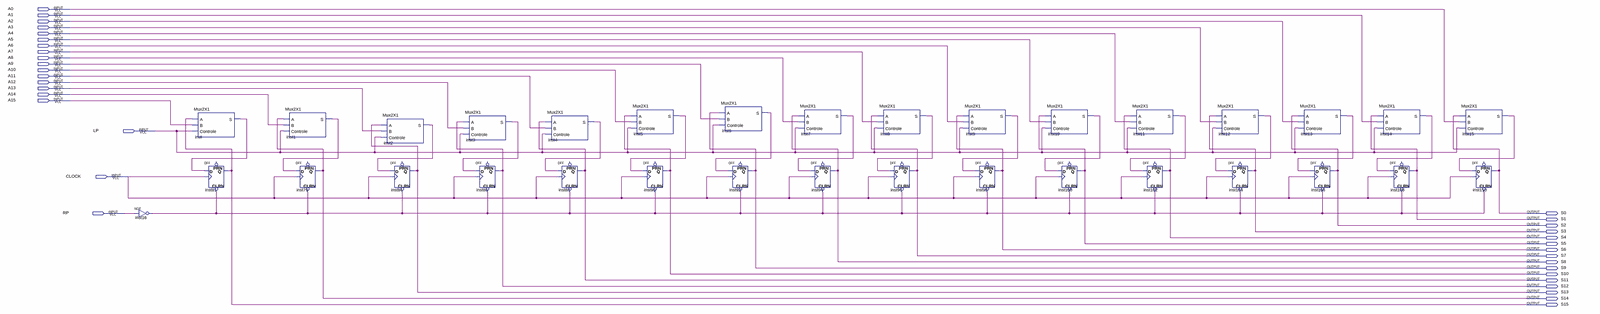
[diagram p0: schematic sheet, whole]
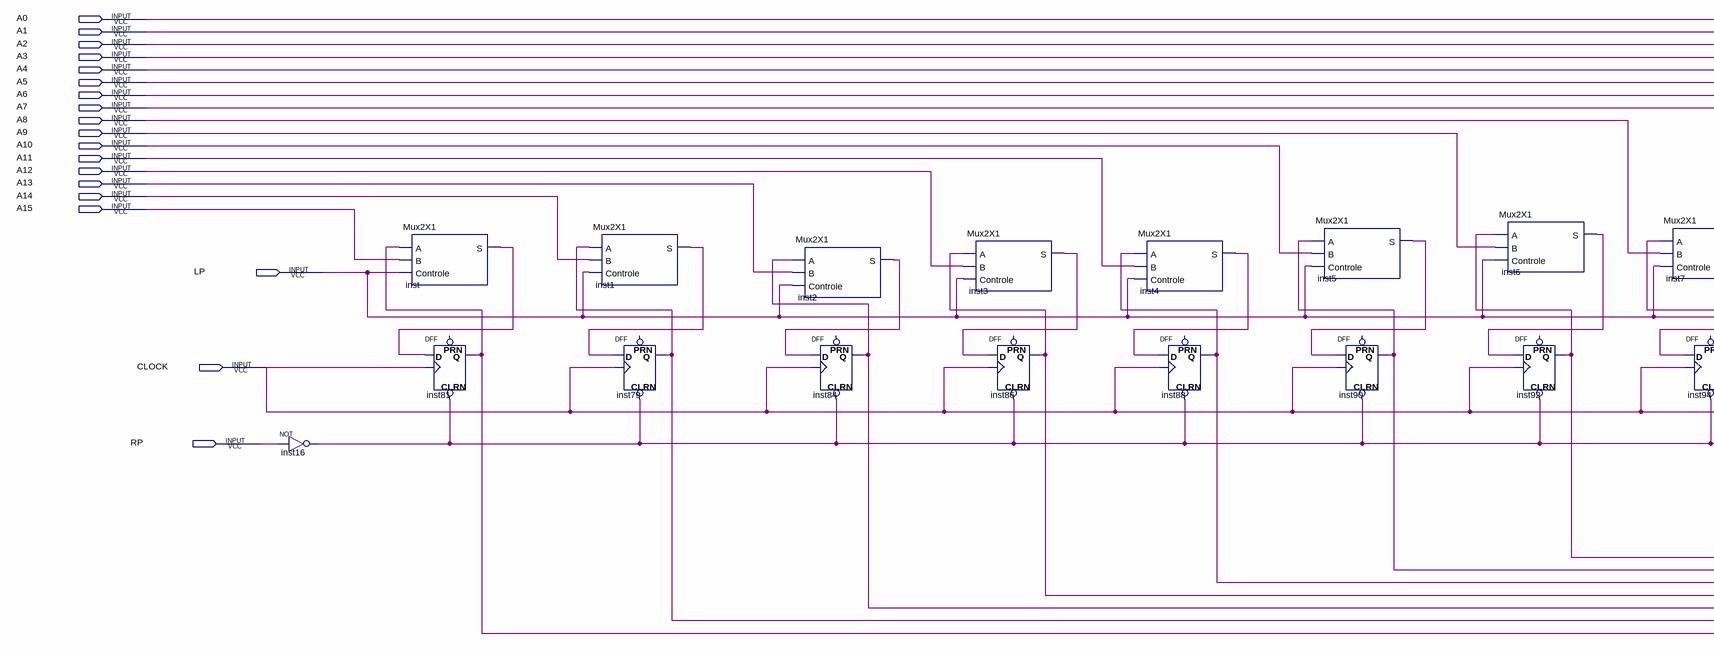
[diagram p1: schematic sheet, left part]
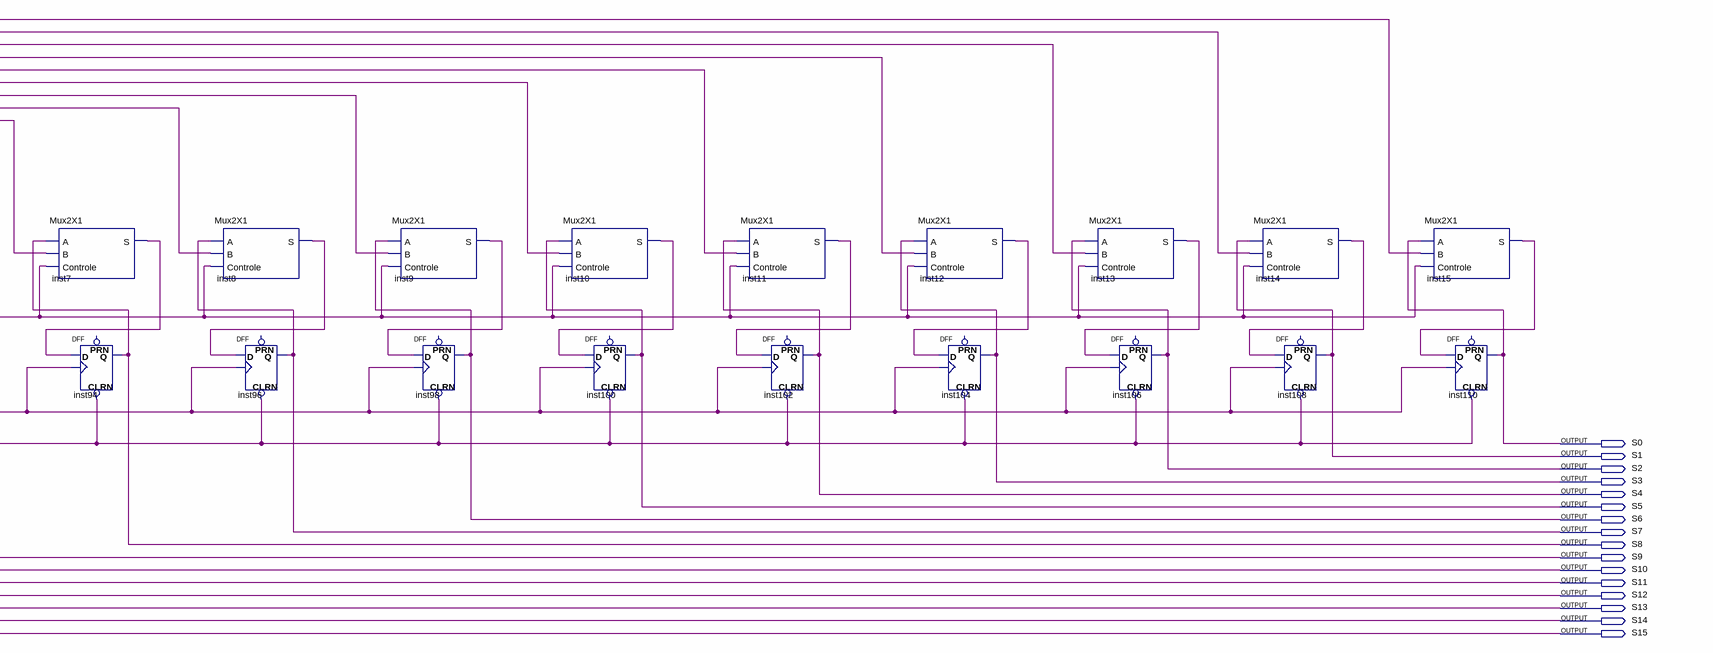
[diagram p2: schematic sheet, right part]
// Quartus schematic Registrador16BdP.bdf as structural Verilog: 33 symbols, 35 pins
module Registrador16BdP (
  input  A0,
  input  A1,
  input  A2,
  input  A3,
  input  A4,
  input  A5,
  input  A6,
  input  A7,
  input  A8,
  input  A9,
  input  A10,
  input  A11,
  input  A12,
  input  A13,
  input  A14,
  input  A15,
  input  LP,
  input  CLOCK,
  input  RP,
  output S0,
  output S1,
  output S2,
  output S3,
  output S4,
  output S5,
  output S6,
  output S7,
  output S8,
  output S9,
  output S10,
  output S11,
  output S12,
  output S13,
  output S14,
  output S15
);

  wire inst1_s, inst2_s, inst3_s, inst4_s, inst5_s, inst6_s, inst7_s, inst8_s, inst9_s, inst10_s, inst11_s,
       inst12_s, inst13_s, inst14_s, inst15_s, inst16_out, inst_s;

  not inst16 (inst16_out, RP);
  Mux2X1 inst (.A(S15), .B(A15), .Controle(LP), .S(inst_s));
  DFF inst81 (.CLRN(inst16_out), .CLK(CLOCK), .D(inst_s), .Q(S15));  // open: PRN
  Mux2X1 inst1 (.A(S14), .B(A14), .Controle(LP), .S(inst1_s));
  DFF inst79 (.CLRN(inst16_out), .CLK(CLOCK), .D(inst1_s), .Q(S14));  // open: PRN
  Mux2X1 inst2 (.A(S13), .B(A13), .Controle(LP), .S(inst2_s));
  DFF inst84 (.CLRN(inst16_out), .CLK(CLOCK), .D(inst2_s), .Q(S13));  // open: PRN
  Mux2X1 inst3 (.A(S12), .B(A12), .Controle(LP), .S(inst3_s));
  DFF inst86 (.CLRN(inst16_out), .CLK(CLOCK), .D(inst3_s), .Q(S12));  // open: PRN
  Mux2X1 inst4 (.A(S11), .B(A11), .Controle(LP), .S(inst4_s));
  DFF inst88 (.CLRN(inst16_out), .CLK(CLOCK), .D(inst4_s), .Q(S11));  // open: PRN
  Mux2X1 inst5 (.A(S10), .B(A10), .Controle(LP), .S(inst5_s));
  DFF inst90 (.CLRN(inst16_out), .CLK(CLOCK), .D(inst5_s), .Q(S10));  // open: PRN
  Mux2X1 inst6 (.A(S9), .B(A9), .Controle(LP), .S(inst6_s));
  DFF inst92 (.CLRN(inst16_out), .CLK(CLOCK), .D(inst6_s), .Q(S9));  // open: PRN
  Mux2X1 inst7 (.A(S8), .B(A8), .Controle(LP), .S(inst7_s));
  DFF inst94 (.CLRN(inst16_out), .CLK(CLOCK), .D(inst7_s), .Q(S8));  // open: PRN
  Mux2X1 inst8 (.A(S7), .B(A7), .Controle(LP), .S(inst8_s));
  DFF inst96 (.CLRN(inst16_out), .CLK(CLOCK), .D(inst8_s), .Q(S7));  // open: PRN
  Mux2X1 inst9 (.A(S6), .B(A6), .Controle(LP), .S(inst9_s));
  DFF inst98 (.CLRN(inst16_out), .CLK(CLOCK), .D(inst9_s), .Q(S6));  // open: PRN
  Mux2X1 inst10 (.A(S5), .B(A5), .Controle(LP), .S(inst10_s));
  DFF inst100 (.CLRN(inst16_out), .CLK(CLOCK), .D(inst10_s), .Q(S5));  // open: PRN
  Mux2X1 inst11 (.A(S4), .B(A4), .Controle(LP), .S(inst11_s));
  DFF inst102 (.CLRN(inst16_out), .CLK(CLOCK), .D(inst11_s), .Q(S4));  // open: PRN
  Mux2X1 inst12 (.A(S3), .B(A3), .Controle(LP), .S(inst12_s));
  DFF inst104 (.CLRN(inst16_out), .CLK(CLOCK), .D(inst12_s), .Q(S3));  // open: PRN
  Mux2X1 inst13 (.A(S2), .B(A2), .Controle(LP), .S(inst13_s));
  DFF inst106 (.CLRN(inst16_out), .CLK(CLOCK), .D(inst13_s), .Q(S2));  // open: PRN
  Mux2X1 inst14 (.A(S1), .B(A1), .Controle(LP), .S(inst14_s));
  DFF inst108 (.CLRN(inst16_out), .CLK(CLOCK), .D(inst14_s), .Q(S1));  // open: PRN
  Mux2X1 inst15 (.A(S0), .B(A0), .Controle(LP), .S(inst15_s));
  DFF inst110 (.CLRN(inst16_out), .CLK(CLOCK), .D(inst15_s), .Q(S0));  // open: PRN
endmodule
